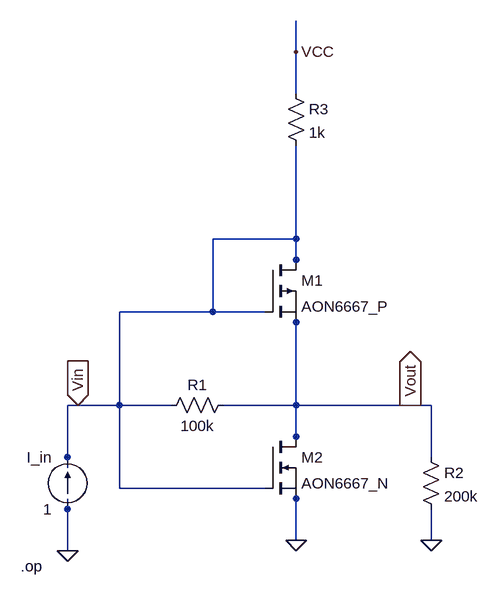
[diagram p0: schematic MOSFET_circuit.asc]
MOSFET_circuit.asc, the LTspice schematic file:
Version 4
SHEET 1 880 680
WIRE 352 -400 352 -448
WIRE 352 -336 352 -400
WIRE 352 -112 352 -256
WIRE 352 -112 224 -112
WIRE 352 -80 352 -112
WIRE 352 -64 352 -80
WIRE 224 0 224 -112
WIRE 224 0 80 0
WIRE 304 0 224 0
WIRE 352 16 352 0
WIRE 16 144 0 144
WIRE 80 144 80 0
WIRE 80 144 16 144
WIRE 160 144 80 144
WIRE 352 144 352 16
WIRE 352 144 240 144
WIRE 528 144 352 144
WIRE 560 144 528 144
WIRE 352 192 352 144
WIRE 352 208 352 192
WIRE 0 224 0 144
WIRE 560 224 560 144
WIRE 0 240 0 224
WIRE 80 272 80 144
WIRE 304 272 80 272
WIRE 352 288 352 272
WIRE 0 304 0 288
WIRE 352 352 352 288
WIRE 560 352 560 304
WIRE 0 368 0 304
FLAG 0 368 0
FLAG 16 144 Vin
IOPIN 16 144 In
FLAG 352 352 0
FLAG 560 352 0
FLAG 528 144 Vout
IOPIN 528 144 Out
FLAG 352 -400 VCC
SYMBOL current 0 304 R180
WINDOW 0 24 80 Left 2
WINDOW 3 24 0 Left 2
SYMATTR InstName I_in
SYMATTR Value 1
SYMBOL res 256 128 R90
WINDOW 0 0 56 VBottom 2
WINDOW 3 32 56 VTop 2
SYMATTR InstName R1
SYMATTR Value 100k
SYMBOL pmos 304 -80 R0
SYMATTR InstName M1
SYMATTR Value AON6667_P
SYMBOL nmos 304 192 R0
SYMATTR InstName M2
SYMATTR Value AON6667_N
SYMBOL res 544 208 R0
SYMATTR InstName R2
SYMATTR Value 200k
SYMBOL res 336 -352 R0
SYMATTR InstName R3
SYMATTR Value 1k
TEXT -72 392 Left 2 !.op

The netlist it stands for:
* MOSFET_circuit.asc
I_in 0 Vin 1
R1 Vout Vin 100k
M1 Vin Vin Vout Vout AON6667_P
M2 Vout Vin 0 0 AON6667_N
R2 Vout 0 200k
R3 VCC Vin 1k
.model NMOS NMOS
.model PMOS PMOS
.lib standard.mos
.op
.backanno
.end